# Altium schematic sheet boot_cfg.SchDoc
size A2; SheetNumber: 12; SheetTotal: 15
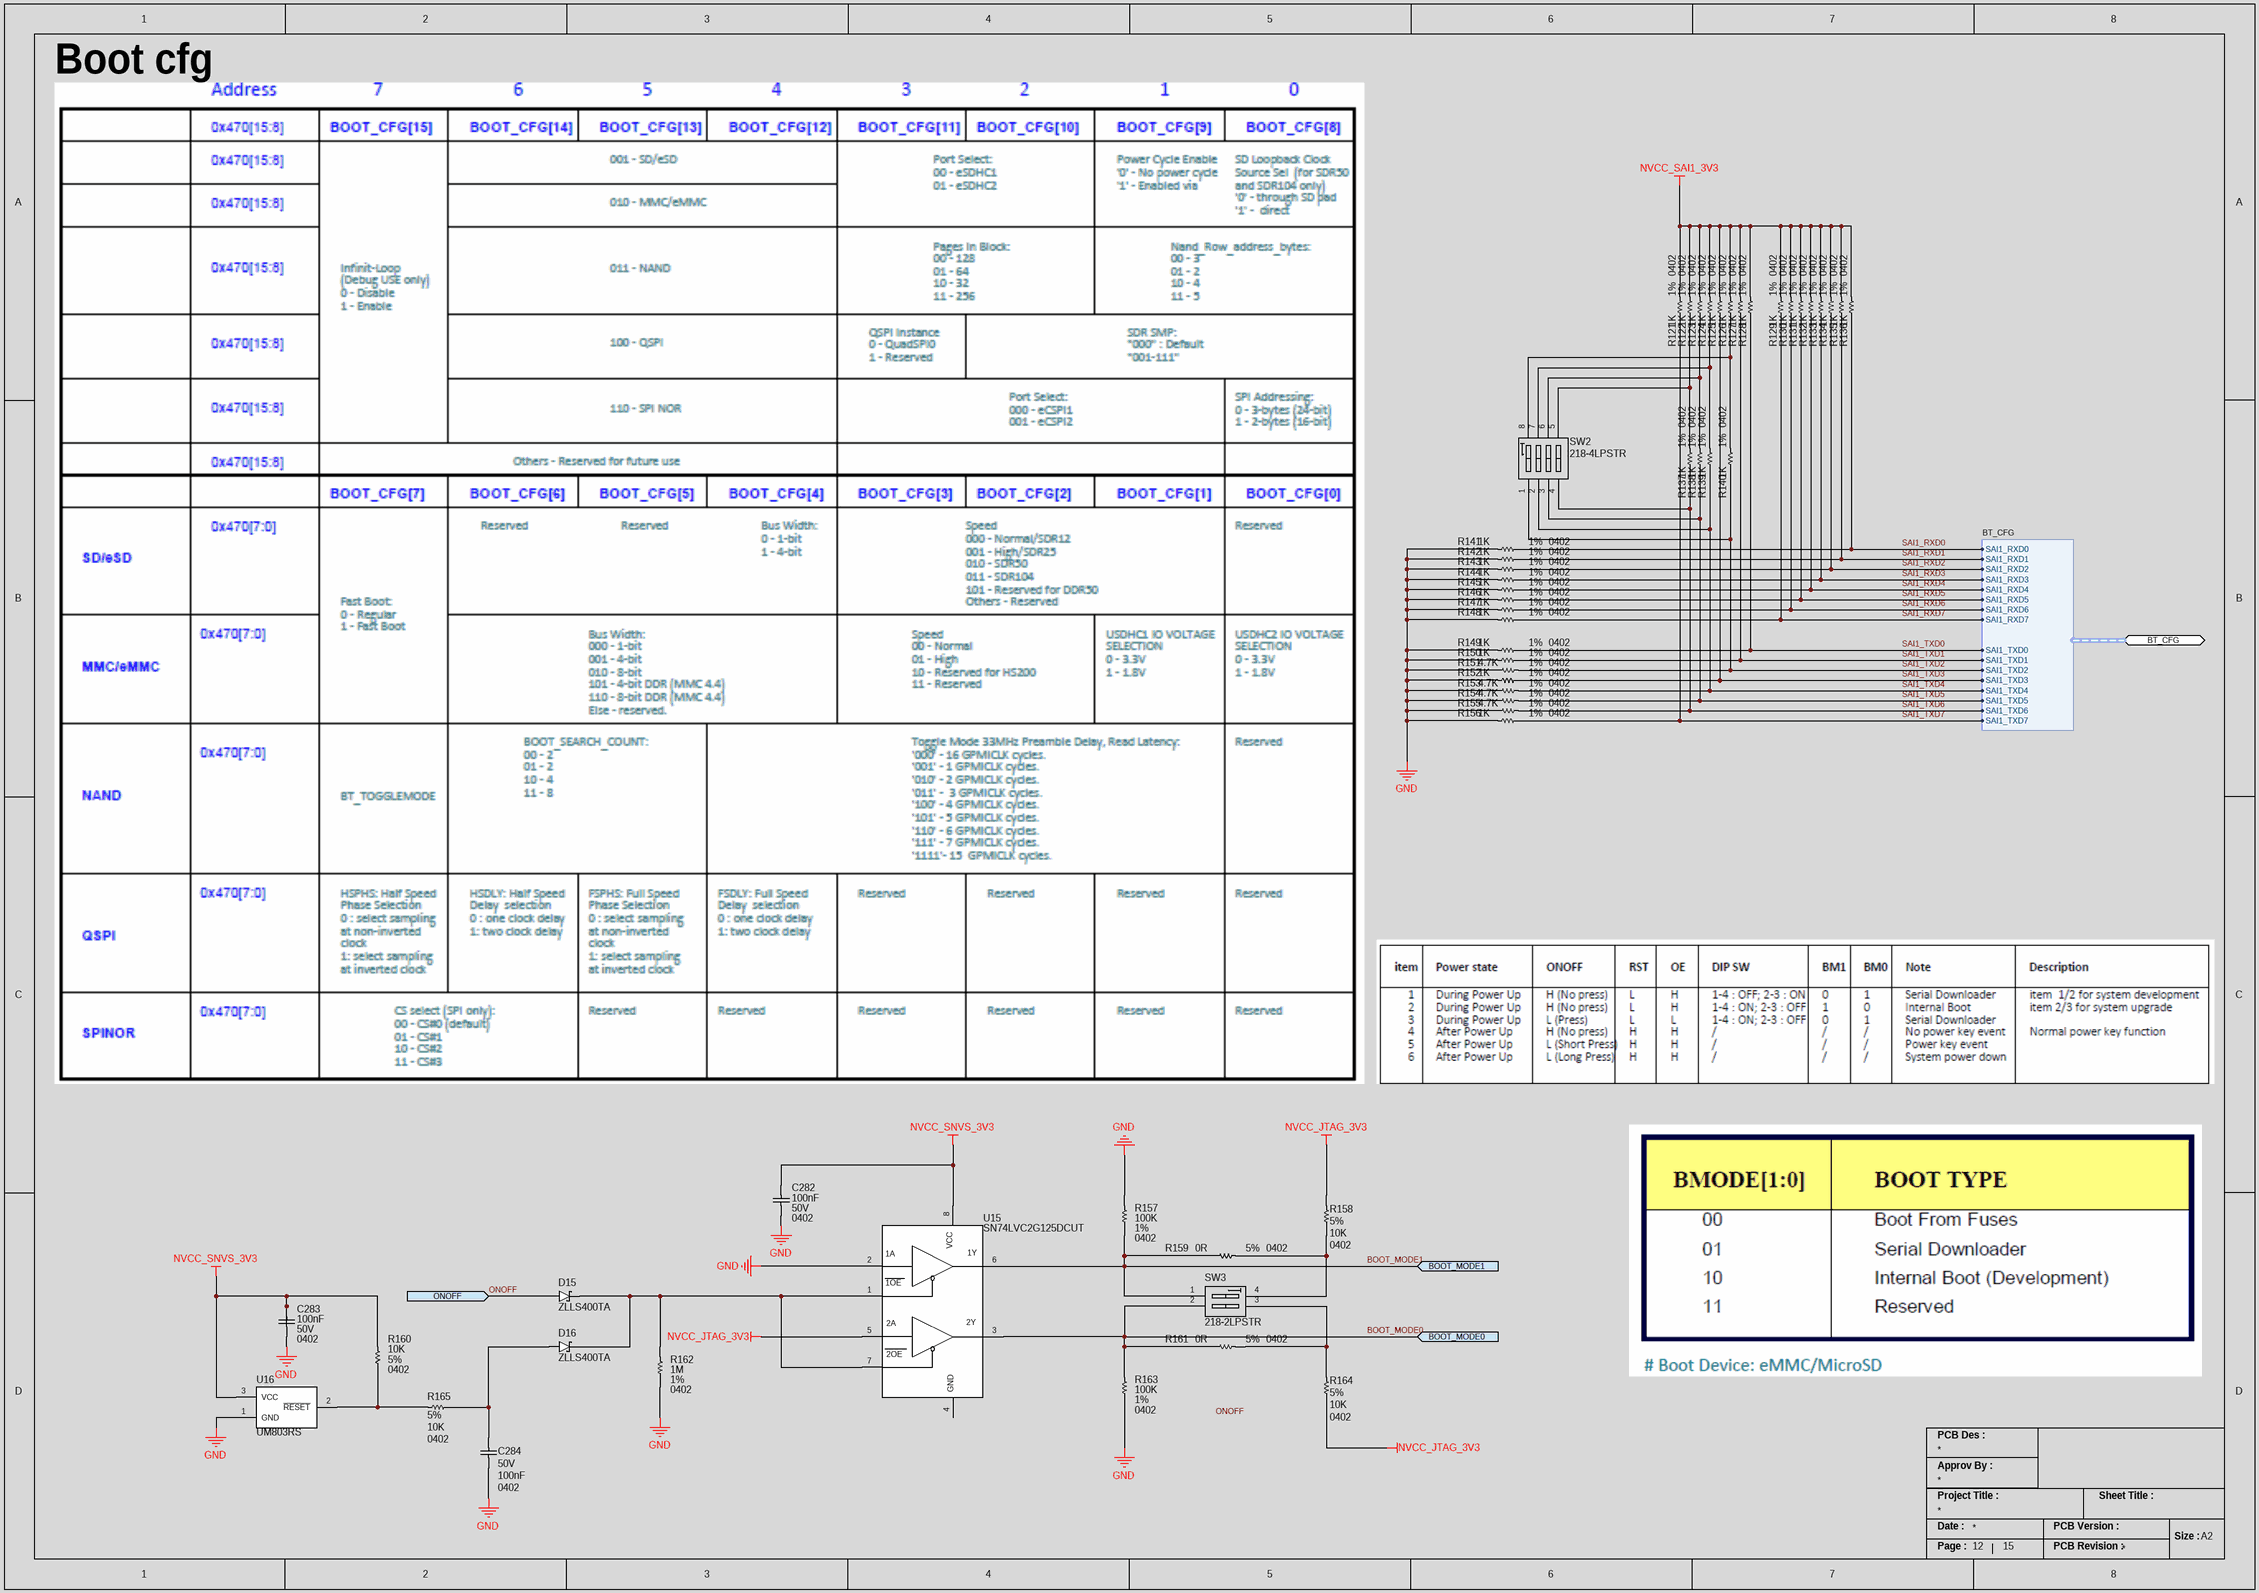
[diagram p0: boot_cfg.SchDoc]

## Parts
C282  Voltage Rating: 50V  Capacitance: 100nF  Case/Package: 0402  [CAP_0402_CAPC1005X05N]  (hidden comment: GRM155R71H104KE14D)
C283  Voltage Rating: 50V  Capacitance: 100nF  Case/Package: 0402  [CAP_0402_CAPC1005X05N]  (hidden comment: GRM155R71H104KE14D)
C284  Voltage Rating: 50V  Capacitance: 100nF  Case/Package: 0402  [CAP_0402_CAPC1005X05N]  (hidden comment: GRM155R71H104KE14D)
D15  ZLLS400TA  [DIO_SOD2512X113N]
D16  ZLLS400TA  [DIO_SOD2512X113N]
R121  Resistance: 1K  Tolerance: 1%  Case/Package: 0402  [RES_0402_RESC1005X04N]  (hidden comment: ERJ-2RKF1001X)
R122  Resistance: 1K  Tolerance: 1%  Case/Package: 0402  [RES_0402_RESC1005X04N]  (hidden comment: ERJ-2RKF1001X)
R123  Resistance: 1K  Tolerance: 1%  Case/Package: 0402  [RES_0402_RESC1005X04N]  (hidden comment: ERJ-2RKF1001X)
R124  Resistance: 1K  Tolerance: 1%  Case/Package: 0402  [RES_0402_RESC1005X04N]  (hidden comment: ERJ-2RKF1001X)
R125  Resistance: 1K  Tolerance: 1%  Case/Package: 0402  [RES_0402_RESC1005X04N]  (hidden comment: ERJ-2RKF1001X)
R126  Resistance: 1K  Tolerance: 1%  Case/Package: 0402  [RES_0402_RESC1005X04N]  (hidden comment: ERJ-2RKF1001X)
R127  Resistance: 1K  Tolerance: 1%  Case/Package: 0402  [RES_0402_RESC1005X04N]  (hidden comment: ERJ-2RKF1001X)
R128  Resistance: 1K  Tolerance: 1%  Case/Package: 0402  [RES_0402_RESC1005X04N]  (hidden comment: ERJ-2RKF1001X)
R129  Resistance: 1K  Tolerance: 1%  Case/Package: 0402  [RES_0402_RESC1005X04N]  (hidden comment: ERJ-2RKF1001X)
R130  Resistance: 1K  Tolerance: 1%  Case/Package: 0402  [RES_0402_RESC1005X04N]  (hidden comment: ERJ-2RKF1001X)
R131  Resistance: 1K  Tolerance: 1%  Case/Package: 0402  [RES_0402_RESC1005X04N]  (hidden comment: ERJ-2RKF1001X)
R132  Resistance: 1K  Tolerance: 1%  Case/Package: 0402  [RES_0402_RESC1005X04N]  (hidden comment: ERJ-2RKF1001X)
R133  Resistance: 1K  Tolerance: 1%  Case/Package: 0402  [RES_0402_RESC1005X04N]  (hidden comment: ERJ-2RKF1001X)
R134  Resistance: 1K  Tolerance: 1%  Case/Package: 0402  [RES_0402_RESC1005X04N]  (hidden comment: ERJ-2RKF1001X)
R135  Resistance: 1K  Tolerance: 1%  Case/Package: 0402  [RES_0402_RESC1005X04N]  (hidden comment: ERJ-2RKF1001X)
R136  Resistance: 1K  Tolerance: 1%  Case/Package: 0402  [RES_0402_RESC1005X04N]  (hidden comment: ERJ-2RKF1001X)
R137  Resistance: 1K  Tolerance: 1%  Case/Package: 0402  [RES_0402_RESC1005X04N]  (hidden comment: ERJ-2RKF1001X)
R138  Resistance: 1K  Tolerance: 1%  Case/Package: 0402  [RES_0402_RESC1005X04N]  (hidden comment: ERJ-2RKF1001X)
R139  Resistance: 1K  Tolerance: 1%  Case/Package: 0402  [RES_0402_RESC1005X04N]  (hidden comment: ERJ-2RKF1001X)
R140  Resistance: 1K  Tolerance: 1%  Case/Package: 0402  [RES_0402_RESC1005X04N]  (hidden comment: ERJ-2RKF1001X)
R141  Resistance: 1K  Tolerance: 1%  Case/Package: 0402  [RES_0402_RESC1005X04N]  (hidden comment: ERJ-2RKF1001X)
R142  Resistance: 1K  Tolerance: 1%  Case/Package: 0402  [RES_0402_RESC1005X04N]  (hidden comment: ERJ-2RKF1001X)
R143  Resistance: 1K  Tolerance: 1%  Case/Package: 0402  [RES_0402_RESC1005X04N]  (hidden comment: ERJ-2RKF1001X)
R144  Resistance: 1K  Tolerance: 1%  Case/Package: 0402  [RES_0402_RESC1005X04N]  (hidden comment: ERJ-2RKF1001X)
R145  Resistance: 1K  Tolerance: 1%  Case/Package: 0402  [RES_0402_RESC1005X04N]  (hidden comment: ERJ-2RKF1001X)
R146  Resistance: 1K  Tolerance: 1%  Case/Package: 0402  [RES_0402_RESC1005X04N]  (hidden comment: ERJ-2RKF1001X)
R147  Resistance: 1K  Tolerance: 1%  Case/Package: 0402  [RES_0402_RESC1005X04N]  (hidden comment: ERJ-2RKF1001X)
R148  Resistance: 1K  Tolerance: 1%  Case/Package: 0402  [RES_0402_RESC1005X04N]  (hidden comment: ERJ-2RKF1001X)
R149  Resistance: 1K  Tolerance: 1%  Case/Package: 0402  [RES_0402_RESC1005X04N]  (hidden comment: ERJ-2RKF1001X)
R150  Resistance: 1K  Tolerance: 1%  Case/Package: 0402  [RES_0402_RESC1005X04N]  (hidden comment: ERJ-2RKF1001X)
R151  Tolerance: 1%  Case Code (Imperial): 0402  Resistance: 4.7K  [RES_0402_RESC1005X04N]  (hidden comment: ERJ-2RKF4701X)
R152  Resistance: 1K  Tolerance: 1%  Case/Package: 0402  [RES_0402_RESC1005X04N]  (hidden comment: ERJ-2RKF1001X)
R153  Tolerance: 1%  Case Code (Imperial): 0402  Resistance: 4.7K  [RES_0402_RESC1005X04N]  (hidden comment: ERJ-2RKF4701X)
R154  Tolerance: 1%  Case Code (Imperial): 0402  Resistance: 4.7K  [RES_0402_RESC1005X04N]  (hidden comment: ERJ-2RKF4701X)
R155  Tolerance: 1%  Case Code (Imperial): 0402  Resistance: 4.7K  [RES_0402_RESC1005X04N]  (hidden comment: ERJ-2RKF4701X)
R156  Resistance: 1K  Tolerance: 1%  Case/Package: 0402  [RES_0402_RESC1005X04N]  (hidden comment: ERJ-2RKF1001X)
R157  Resistance: 100K  Tolerance: 1%  Case/Package: 0402  [RES_0402_RESC1005X04N]  (hidden comment: RC0402FR-07100KL)
R158  Tolerance: 5%  Resistance: 10K  Case/Package: 0402  [RES_0402_RESC1005X04N]  (hidden comment: ERJ-2GEJ103X)
R159  Case Code (Imperial): 0402  Tolerance: 5%  Resistance: 0R  [RES_0402_RESC1005X04N]  (hidden comment: ERJ-2GE0R00X)
R160  Tolerance: 5%  Resistance: 10K  Case/Package: 0402  [RES_0402_RESC1005X04N]  (hidden comment: ERJ-2GEJ103X)
R161  Case Code (Imperial): 0402  Tolerance: 5%  Resistance: 0R  [RES_0402_RESC1005X04N]  (hidden comment: ERJ-2GE0R00X)
R162  Resistance: 1M  Tolerance: 1%  Case/Package: 0402  [RES_0402_RESC1005X04N]  (hidden comment: CR0402-FX-1004GLF)
R163  Resistance: 100K  Tolerance: 1%  Case/Package: 0402  [RES_0402_RESC1005X04N]  (hidden comment: RC0402FR-07100KL)
R164  Tolerance: 5%  Resistance: 10K  Case/Package: 0402  [RES_0402_RESC1005X04N]  (hidden comment: ERJ-2GEJ103X)
R165  Tolerance: 5%  Resistance: 10K  Case/Package: 0402  [RES_0402_RESC1005X04N]  (hidden comment: ERJ-2GEJ103X)
SW2  218-4LPSTR  [SW_DIP_SOIC127P844X265-8N]
SW3  218-2LPSTR  [SW_DIP_2P_2182LPSTR]
U15  SN74LVC2G125DCUT  [IC_BUFF_SOP50P310X90-8N]
U16  UM803RS  [IC_SUP_VOL_UM805RS]

## Ports
BOOT_MODE0 (in), BOOT_MODE1 (in), BT_CFG (bidir, harness BT_CFG), ONOFF (in)

## Harnesses
BT_CFG: SAI1_RXD0, SAI1_RXD1, SAI1_RXD2, SAI1_RXD3, SAI1_RXD4, SAI1_RXD5, SAI1_RXD6, SAI1_RXD7, SAI1_TXD0, SAI1_TXD1, SAI1_TXD2, SAI1_TXD3, SAI1_TXD4, SAI1_TXD5, SAI1_TXD6, SAI1_TXD7

## Nets
GND: C282.1 C283.1 C284.1 R141.2 R142.2 R143.2 R144.2 R145.2 R146.2 R147.2 R148.2 R149.2 R150.2 R151.1 R152.2 R153.1 R154.1 R155.1 R156.2 R157.2 R162.1 R163.1 U15.2(1A) U16.1(GND)
NVCC_JTAG_3V3: R158.2 R164.1 U15.5(2A)
NVCC_SAI1_3V3: R121.2 R122.2 R123.2 R124.2 R125.2 R126.2 R127.2 R128.2 R129.2 R130.2 R131.2 R132.2 R133.2 R134.2 R135.2 R136.2
NVCC_SNVS_3V3: C282.2 C283.2 R160.2 U15.8(VCC) U16.3(VCC)
BOOT_MODE0: R161.1 R163.2 SW3.2(A2) U15.3(2Y) ; port BOOT_MODE0
BOOT_MODE1: R157.1 R159.1 SW3.1(A1) U15.6(1Y) ; port BOOT_MODE1
ONOFF: D15.2(A) ; port ONOFF
SAI1_RXD0: R136.1 R141.1 ; port BT_CFG.SAI1_RXD0
SAI1_RXD1: R135.1 R142.1 ; port BT_CFG.SAI1_RXD1
SAI1_RXD2: R134.1 R143.1 ; port BT_CFG.SAI1_RXD2
SAI1_RXD3: R133.1 R144.1 ; port BT_CFG.SAI1_RXD3
SAI1_RXD4: R132.1 R145.1 ; port BT_CFG.SAI1_RXD4
SAI1_RXD5: R131.1 R146.1 ; port BT_CFG.SAI1_RXD5
SAI1_RXD6: R130.1 R147.1 ; port BT_CFG.SAI1_RXD6
SAI1_RXD7: R129.1 R148.1 ; port BT_CFG.SAI1_RXD7
SAI1_TXD0: R128.1 R149.1 ; port BT_CFG.SAI1_TXD0
SAI1_TXD1: R127.1 R150.1 ; port BT_CFG.SAI1_TXD1
SAI1_TXD2: R140.1 R151.2 SW2.1(A1) ; port BT_CFG.SAI1_TXD2
SAI1_TXD3: R125.1 R152.1 ; port BT_CFG.SAI1_TXD3
SAI1_TXD4: R139.1 R153.2 SW2.2(A2) ; port BT_CFG.SAI1_TXD4
SAI1_TXD5: R138.1 R154.2 SW2.3(A3) ; port BT_CFG.SAI1_TXD5
SAI1_TXD6: R137.1 R155.2 SW2.4(A4) ; port BT_CFG.SAI1_TXD6
SAI1_TXD7: R121.1 R156.1 ; port BT_CFG.SAI1_TXD7
NetC284_2: C284.2 D16.2(A) R165.1
NetD15_1: D15.1(K) D16.1(K) R162.2 U15.1(~{1OE}) U15.7(~{2OE})
NetR122_1: R122.1 R137.2 SW2.5(B4)
NetR123_1: R123.1 R138.2 SW2.6(B3)
NetR124_1: R124.1 R139.2 SW2.7(B2)
NetR126_1: R126.1 R140.2 SW2.8(B1)
NetR158_1: R158.1 R159.2 SW3.4(B1)
NetR160_1: R160.1 R165.2 U16.2(~{RESET})
NetR161_2: R161.2 R164.2 SW3.3(B2)

Not connected (* = marked no-connect by the designer): U15 4(GND)

## Notes on the sheet
- Boot cfg
- Labels drawn without touching a wire or pin: ONOFF
- PCB Des :
- Approv By :
- Project Title :
- Sheet Title :
- Date :
- Page :
- PCB Version :
- PCB Revision :
- Size :
- A2
- (in symbol IC_BUFFER_2CH_SN74LVC2G125DCUT) 1OE; 2OE

## Library data of the parts
C282-C284 = CAP_100NF_50V_X7R_0402: Multilayer Ceramic Capacitor, 0.1 uF, 16 V, ± 10%, X7R, 0402 [1005 Metric]; Manufacturer: Murata; Dissipation Factor: 0.025%; Temperature Coefficient: 30ppm/°C; Supplier 1: DigiKey; Manufacturer Part Number: GRM155R71H104KE14D; RoHS: Yes; Category: Ceramic Capacitors; Stock 1: 13730790; Pricing 1: 1=0.1, 10=0.023, 50=0.0132, 100=0.0102, 500=0.00768, 1000=0.00603, 2500=0.00548, 5000=0.00504 (USD); Mount: Surface Mount; Number of Pins: 2NUMBER; Case Code (Metric): 1005; Material: Ceramic; Case Code (Imperial): 0402; Weight: 0.000212oz; Dielectric Material: Ceramic; Min Operating Temperature: -55°C; Max Operating Temperature: 125°C; Packaging: Tape and Reel; Package Quantity: 10000; Series: GRM; Tolerance: 10%; Dielectric: X7R; Termination: SMD/SMT; Voltage: 50V; Voltage Rating (DC): 50V; Construction: Flat; Length: 1mm; Width: 0.5mm; Height: 0.5mm; Depth: 0.5mm; Thickness: 0.022inch; Reach SVHC Compliant: No; RoHS Compliant: Yes; Lead Free: 5697LeadFree; ComponentLink1URL: http://www.farnell.com/datasheets/2079156.pdf?src-supplier=Farnell; ComponentLink1Description: http://www.farnell.com/datasheets/2079156.pdf?src-supplier=Farnell; ComponentLink2URL: http://www.mouser.com/ds/2/281/c02e-2905.pdf?src-supplier=Mouser; ComponentLink2Description: http://www.mouser.com/ds/2/281/c02e-2905.pdf?src-supplier=Mouser; ComponentLink3URL: http://www.farnell.com/datasheets/2079156.pdf?src-supplier=Newark; ComponentLink3Description: http://www.farnell.com/datasheets/2079156.pdf?src-supplier=Newark; ComponentLink4URL: https://datasheet.octopart.com/GRM155R71H104KE14D-Murata-datasheet-22122223.pdf?src-supplier=Future+Electronics; ComponentLink4Description: https://datasheet.octopart.com/GRM155R71H104KE14D-Murata-datasheet-22122223.pdf?src-supplier=Future+Electronics; ComponentLink5URL: https://search.murata.co.jp/Ceramy/image/img/A01X/G101/ENG/GRM155R71H104KE14-01.pdf?src-supplier=Digi-Key; ComponentLink5Description: https://search.murata.co.jp/Ceramy/image/img/A01X/G101/ENG/GRM155R71H104KE14-01.pdf?src-supplier=Digi-Key; ComponentLink6URL: http://psearch.en.murata.com/capacitor/product/GRM155R71H104KE14%23.pdf?src-supplier=Avnet; ComponentLink6Description: http://psearch.en.murata.com/capacitor/product/GRM155R71H104KE14%23.pdf?src-supplier=Avnet; ComponentLink7URL: https://datasheet.octopart.com/GRM155R71H104KE14D-Murata-datasheet-66077078.pdf?src-supplier=Element14; ComponentLink7Description: https://datasheet.octopart.com/GRM155R71H104KE14D-Murata-datasheet-66077078.pdf?src-supplier=Element14; Supplier Part Number 1: 490-10700-6-ND; Supplier 2: Digikey; Stock 2: 3706055; Pricing 2: 1=0.1, 10=0.037, 50=0.021, 100=0.0162, 500=0.01224, 1000=0.00961, 2500=0.00874, 5000=0.00804 (USD); Halogen Free: 5694HalogenFree; ComponentLink8URL: http://www.mouser.com/ds/2/447/UPY-GPHC_X5R_4V-to-50V_25-1131599.pdf?src-supplier=Mouser; ComponentLink8Description: http://www.mouser.com/ds/2/447/UPY-GPHC_X5R_4V-to-50V_25-1131599.pdf?src-supplier=Mouser; ComponentLink9URL: https://datasheet.octopart.com/CC0402KRX5R8BB104-Yageo-datasheet-137700082.pdf?src-supplier=Future+Electronics; ComponentLink9Description: https://datasheet.octopart.com/CC0402KRX5R8BB104-Yageo-datasheet-137700082.pdf?src-supplier=Future+Electronics; ComponentLink10URL: http://www.yageo.com/documents/recent/UPY-GPHC_X5R_4V-to-50V_25.pdf?src-supplier=Digikey; ComponentLink10Description: http://www.yageo.com/documents/recent/UPY-GPHC_X5R_4V-to-50V_25.pdf?src-supplier=Digikey; ComponentLink11URL: https://datasheet.octopart.com/CC0402KRX5R8BB104-Yageo-datasheet-140260304.pdf?src-supplier=Newark; ComponentLink11Description: https://datasheet.octopart.com/CC0402KRX5R8BB104-Yageo-datasheet-140260304.pdf?src-supplier=Newark; ComponentLink12URL: https://datasheet.octopart.com/CC0402KRX5R8BB104-Yageo-datasheet-170350636.pdf?src-supplier=Future+Electronics; ComponentLink12Description: https://datasheet.octopart.com/CC0402KRX5R8BB104-Yageo-datasheet-170350636.pdf?src-supplier=Future+Electronics; ComponentLink13URL: http://www.yageo.com/documents/recent/UPY-GPHC_X5R_4V-to-50V-16.pdf?src-supplier=Future+Electronics; ComponentLink13Description: http://www.yageo.com/documents/recent/UPY-GPHC_X5R_4V-to-50V-16.pdf?src-supplier=Future+Electronics; Supplier Part Number 2: 311-1697-1-ND
D15 D16 = DIO_SCTKY_40V_520mA_ZLLS400TA: DIODE SCHOTTKY 40V 520MA SOD323; Manufacturer: Diodes Zetex; Peak Non-Repetitive Surge Current: 12A; Max Reverse Current: 10uA; Forward Voltage: 800mV; Reverse Recovery Time: 3ns; Max Forward Surge Current (Ifsm): 2.5A; Power Dissipation: 330mW; Polarity: Standard; Capacitance: 15pF; Supplier 1: Digi-Key; Manufacturer Part Number: ZLLS400TA; RoHS: Yes; Category: Rectifier Diodes; Stock 1: 46017; Pricing 1: 1=0.42, 10=0.359, 100=0.2495, 500=0.19478, 1000=0.15832 (USD); Mount: Surface Mount; Number of Pins: 2; Weight: 0.000173oz; Min Operating Temperature: -55°C; Max Operating Temperature: 150°C; Forward Current: 520mA; Max Repetitive Reverse Voltage (Vrrm): 40V; Package Quantity: 3000; Packaging: Tape and Reel; Average Rectified Current: 520mA; Termination: SMD/SMT; Voltage Rating (DC): 40V; Current Rating: 520mA; Output Current: 520mA; Max Reverse Voltage (DC): 40V; Series: -; Length: 1.8mm; Width: 1.4mm; Height: 0.8mm; Radiation Hardening: No; Lead Free: Lead Free; RoHS Compliant: Yes; ComponentLink1URL: https://datasheet.ciiva.com/914/zlls400-914210.pdf?src-supplier=Digi-Key; ComponentLink1Description: https://datasheet.ciiva.com/914/zlls400-914210.pdf?src-supplier=Digi-Key; ComponentLink2URL: https://datasheet.ciiva.com/914/zlls400-914210.pdf?src-supplier=Avnet; ComponentLink2Description: https://datasheet.ciiva.com/914/zlls400-914210.pdf?src-supplier=Avnet; ComponentLink3URL: https://datasheet.ciiva.com/4715/zlls400-4715517.pdf?src-supplier=Mouser; ComponentLink3Description: https://datasheet.ciiva.com/4715/zlls400-4715517.pdf?src-supplier=Mouser; ComponentLink4URL: https://datasheet.ciiva.com/16379/zlls400-16379288.pdf?src-supplier=Future+Electronics; ComponentLink4Description: https://datasheet.ciiva.com/16379/zlls400-16379288.pdf?src-supplier=Future+Electronics; ComponentLink5URL: https://datasheet.ciiva.com/914/zlls400-914211.pdf?src-supplier=Digi-Key; ComponentLink5Description: https://datasheet.ciiva.com/914/zlls400-914211.pdf?src-supplier=Digi-Key; ComponentLink6URL: https://datasheet.ciiva.com/914/zlls400-914212.pdf?src-supplier=Digi-Key; ComponentLink6Description: https://datasheet.ciiva.com/914/zlls400-914212.pdf?src-supplier=Digi-Key; Supplier Part Number 1: ZLLS400TACT-ND
R121-R150 R152 R156 = RES_1K_1%_100mW_0402: RES SMD 1K OHM 1% 1/10W 0402; Manufacturer: Panasonic; Temperature Coefficient: 100ppm/°C; Max Power Dissipation: 100mW; Voltage Rating (DC): 50V; Supplier 1: Digi-Key; Manufacturer Part Number: ERJ-2RKF1001X; RoHS: Yes; Category: Chip SMD Resistors; Stock 1: 2367361; Pricing 1: 1=0.1, 10=0.029, 50=0.0162, 100=0.0119, 500=0.00728, 1000=0.00535, 5000=0.00384 (USD); Mount: Surface Mount; Number of Pins: 2; Case Code (Imperial): 0402; Case Code (Metric): 1005; Contact Plating: Tin; Min Operating Temperature: -55°C; Max Operating Temperature: 155°C; Packaging: Tape and Reel; Number of Terminations: 2; Features: Automotive AEC-Q200; Voltage Rating: 50V; Power Rating: 100mW; Package Quantity: 1; Termination: SMD/SMT; Resistor Type: Thick Film; Series: ERJ; Resistance Tolerance: 1%; Construction: Rectangular; Technology: THICK FILM; Length: 1mm; Width: 0.5mm; Height: 0.35mm; Depth: 0.5mm; Lead Free: Lead Free; RoHS Compliant: Yes; Reach SVHC Compliant: Yes; Military Standard: Not; Supplier Part Number 1: P1.00KLCT-ND
R151 R153-R155 = RES_4.7K_1%_100mW_0402: Res Thick Film 0402 4.7K Ohm 1% 0.1W ±100ppm/°C Molded SMD Punched Carrier T/R; Manufacturer: Panasonic; Power Rating: 100mW; Voltage Rating: 50V; Supplier 1: Digi-Key; Manufacturer Part Number: ERJ-2RKF4701X; RoHS: Yes; Category: Chip SMD Resistors; Stock 1: 2269675; Pricing 1: 1=0.1, 10=0.024, 50=0.015, 100=0.0125, 500=0.00848, 1000=0.00731, 5000=0.00531 (USD); Case Code (Metric): 1005; Weight: 0.000388oz; Min Operating Temperature: -55°C; Max Operating Temperature: 155°C; Temperature Coefficient: 100ppm/°C; Packaging: Cut Tape; Package Quantity: 10000; Termination: SMD/SMT; Voltage Rating (DC): 50V; Series: ERJ-2Rx; Technology: THICK FILM; Length: 1mm; Width: 0.5mm; Height: 0.35mm; Lead Free: Lead Free; RoHS Compliant: Yes; ComponentLink1URL: https://datasheet.ciiva.com/30053/aoa0000ce2-30053990.pdf?src-supplier=Onlinecomponents.com; ComponentLink1Description: https://datasheet.ciiva.com/30053/aoa0000ce2-30053990.pdf?src-supplier=Onlinecomponents.com; ComponentLink2URL: https://datasheet.ciiva.com/7830/aoa0000ce2-7830727.pdf?src-supplier=Element14; ComponentLink2Description: https://datasheet.ciiva.com/7830/aoa0000ce2-7830727.pdf?src-supplier=Element14; ComponentLink3URL: https://datasheet.ciiva.com/22781/1678782-22781576.pdf?src-supplier=Farnell; ComponentLink3Description: https://datasheet.ciiva.com/22781/1678782-22781576.pdf?src-supplier=Farnell; ComponentLink4URL: https://datasheet.ciiva.com/22667/1678782-22667886.pdf?src-supplier=Element14; ComponentLink4Description: https://datasheet.ciiva.com/22667/1678782-22667886.pdf?src-supplier=Element14; ComponentLink5URL: https://datasheet.ciiva.com/22723/1678782-22723903.pdf?src-supplier=Element14; ComponentLink5Description: https://datasheet.ciiva.com/22723/1678782-22723903.pdf?src-supplier=Element14; Supplier Part Number 1: P4.70KLCT-ND
R157 R163 = RES_100K_1%_100mW_0402: SMD Chip Resistor, 100 kOhm, ± 1%, 63 mW, 0402 [1005 Metric], Thick Film, General Purpose; Manufacturer: Yageo; Temperature Coefficient: 100ppm/°C; Power Rating: 63mW; Voltage Rating: 50V; Supplier 1: Digi-Key; Manufacturer Part Number: RC0402FR-07100KL; RoHS: Yes; Category: Chip SMD Resistors; Stock 1: 27579413; Pricing 1: 1=0.1, 10=0.014, 50=0.0084, 100=0.007, 500=0.00464, 1000=0.00396, 5000=0.00282 (USD); Case Code (Metric): 1005; Case Code (Imperial): 0402; Min Operating Temperature: -55°C; Max Operating Temperature: 155°C; Resistor Type: Thick Film; Packaging: Tape and Reel; Package Quantity: 1; Number of Terminations: 2; Termination: SMD/SMT; Max Power Dissipation: 63mW; Features: Moisture Resistant; Series: RC; Resistance Tolerance: 1%; Construction: Rectangular; Technology: THICK FILM; Voltage Rating (AC): 50V; Length: 0.039inch; Width: 0.02inch; Height: 0.016inch; Depth: 0.5mm; Reach SVHC Compliant: No; RoHS Compliant: Yes; Lead Free: 5697LeadFree; Military Standard: Not; ComponentLink1URL: https://datasheet.ciiva.com/11819/0900766b80c66297-11819452.pdf?src-supplier=Rs; ComponentLink1Description: https://datasheet.ciiva.com/11819/0900766b80c66297-11819452.pdf?src-supplier=Rs; ComponentLink2URL: https://datasheet.ciiva.com/22747/1018594-22747509.pdf?src-supplier=Element14; ComponentLink2Description: https://datasheet.ciiva.com/22747/1018594-22747509.pdf?src-supplier=Element14; ComponentLink3URL: https://datasheet.ciiva.com/2453/pyu-r-int-thick-7-2453362.pdf?src-supplier=Digi-Key; ComponentLink3Description: https://datasheet.ciiva.com/2453/pyu-r-int-thick-7-2453362.pdf?src-supplier=Digi-Key; ComponentLink4URL: https://datasheet.ciiva.com/12667/pyu-rc0402-51-rohs-l-6-r-12667930.pdf?src-supplier=Mouser; ComponentLink4Description: https://datasheet.ciiva.com/12667/pyu-rc0402-51-rohs-l-6-r-12667930.pdf?src-supplier=Mouser; ComponentLink5URL: https://datasheet.ciiva.com/15189/getdatasheetpartid-323696-15189334.pdf?src-supplier=Verical; ComponentLink5Description: https://datasheet.ciiva.com/15189/getdatasheetpartid-323696-15189334.pdf?src-supplier=Verical; ComponentLink6URL: https://datasheet.ciiva.com/2453/pyu-r-int-thick-7-2453363.pdf?src-supplier=Digi-Key; ComponentLink6Description: https://datasheet.ciiva.com/2453/pyu-r-int-thick-7-2453363.pdf?src-supplier=Digi-Key; ComponentLink7URL: https://datasheet.ciiva.com/2453/pyu-r-int-thick-7-2453361.pdf?src-supplier=Digi-Key; ComponentLink7Description: https://datasheet.ciiva.com/2453/pyu-r-int-thick-7-2453361.pdf?src-supplier=Digi-Key; Supplier Part Number 1: 311-100KLRCT-ND
R158 R160 R164 R165 = RES_10K_5%_100mW_0402: Res Thick Film 0402 10K Ohm 5% 1/10W ±200ppm/°C Molded SMD Punched Carrier T/R; Manufacturer: Panasonic; Power Rating: 100mW; Voltage Rating: 50V; Supplier 1: Digi-Key; Manufacturer Part Number: ERJ-2GEJ103X; RoHS: Yes; Category: Chip SMD Resistors; Stock 1: 4696986; Pricing 1: 1=0.1, 10=0.021, 50=0.0132, 100=0.011, 500=0.00744, 1000=0.00639, 5000=0.00464 (USD); Mount: Surface Mount; Contact Plating: Tin; Case Code (Metric): 1005; Case Code (Imperial): 0402; Size Code: 0402; Min Operating Temperature: -55°C; Max Operating Temperature: 155°C; Temperature Coefficient: 200ppm/°C; Packaging: Cut Tape; Resistor Type: Thick Film; Package Quantity: 10000; Number of Terminations: 2; Termination: SMD/SMT; Max Power Dissipation: 100mW; Features: Automotive AEC-Q200; Series: ERJ; Resistance Tolerance: 5%; Technology: THICK FILM; Voltage Rating (DC): 50V; Length: 1mm; Width: 0.5mm; Height: 0.35mm; Depth: 0.5mm; Ratings: AEC-Q200; Radiation Hardening: No; Reach SVHC Compliant: No; RoHS Compliant: Yes; Lead Free: 5697LeadFree; ComponentLink1URL: https://datasheet.ciiva.com/27055/1935721-27055112.pdf?src-supplier=Jameco; ComponentLink1Description: https://datasheet.ciiva.com/27055/1935721-27055112.pdf?src-supplier=Jameco; ComponentLink2URL: https://datasheet.ciiva.com/11821/0900766b80f806dd-11821170.pdf?src-supplier=Rs; ComponentLink2Description: https://datasheet.ciiva.com/11821/0900766b80f806dd-11821170.pdf?src-supplier=Rs; ComponentLink3URL: https://datasheet.ciiva.com/43460/1678796-43460391.pdf?src-supplier=Farnell; ComponentLink3Description: https://datasheet.ciiva.com/43460/1678796-43460391.pdf?src-supplier=Farnell; ComponentLink4URL: https://datasheet.ciiva.com/22785/1678796-22785949.pdf?src-supplier=Farnell; ComponentLink4Description: https://datasheet.ciiva.com/22785/1678796-22785949.pdf?src-supplier=Farnell; ComponentLink5URL: https://datasheet.ciiva.com/46371/1678796-46371910.pdf?src-supplier=Element14; ComponentLink5Description: https://datasheet.ciiva.com/46371/1678796-46371910.pdf?src-supplier=Element14; ComponentLink6URL: https://datasheet.ciiva.com/28514/1678796-28514154.pdf?src-supplier=Element14; ComponentLink6Description: https://datasheet.ciiva.com/28514/1678796-28514154.pdf?src-supplier=Element14; ComponentLink7URL: https://datasheet.ciiva.com/24070/aoa0000ce1-37422-24070679.pdf?src-supplier=Mouser; ComponentLink7Description: https://datasheet.ciiva.com/24070/aoa0000ce1-37422-24070679.pdf?src-supplier=Mouser; ComponentLink8URL: https://datasheet.ciiva.com/16767/70260739-16767130.pdf?src-supplier=Allied+Electronics; ComponentLink8Description: https://datasheet.ciiva.com/16767/70260739-16767130.pdf?src-supplier=Allied+Electronics; ComponentLink9URL: https://datasheet.ciiva.com/16774/70260739-16774504.pdf?src-supplier=Allied+Electronics; ComponentLink9Description: https://datasheet.ciiva.com/16774/70260739-16774504.pdf?src-supplier=Allied+Electronics; ComponentLink10URL: https://datasheet.ciiva.com/9194/aoa0000ce1-9194140.pdf?src-supplier=Avnet; ComponentLink10Description: https://datasheet.ciiva.com/9194/aoa0000ce1-9194140.pdf?src-supplier=Avnet; Supplier Part Number 1: P10KJCT-ND
R159 R161 = RES_0R_5%_100mW_0402: SMD Chip Resistor, Jumper, 0 ohm, 100 mW, 0402 [1005 Metric], Thick Film, General Purpose; Manufacturer: Panasonic; Power Rating: 100mW; Voltage Rating: 50V; Temperature Coefficient: 600ppm/°C; Supplier 1: Mouser; Manufacturer Part Number: ERJ-2GE0R00X; RoHS: Yes; Category: Chip SMD Resistors; Stock 1: 10989354; Pricing 1: 1=0.1, 10=0.013, 50=0.013, 100=0.006, 1000=0.004, 2500=0.003, 10000=0.003 (USD); Mount: Surface Mount; Case/Package: 0402; Contact Plating: Tin; Case Code (Metric): 1005; Size Code: 0402; Min Operating Temperature: -55°C; Max Operating Temperature: 155°C; Resistor Type: Thick Film; Packaging: Cut Tape; Package Quantity: 10000; Number of Terminations: 2; Termination: SMD/SMT; Max Power Dissipation: 100mW; Voltage Rating (DC): 50V; Features: Automotive AEC-Q200; Series: ERJ; Construction: Rectangular; Technology: THICK FILM; Length: 1mm; Width: 0.5mm; Height: 0.35mm; Depth: 0.5mm; Ratings: AEC-Q200; Radiation Hardening: No; Reach SVHC Compliant: No; Military Standard: Not; Lead Free: Lead Free; RoHS Compliant: Yes; ComponentLink1URL: https://datasheet.ciiva.com/11821/0900766b80f806dd-11821176.pdf?src-supplier=Rs; ComponentLink1Description: https://datasheet.ciiva.com/11821/0900766b80f806dd-11821176.pdf?src-supplier=Rs; ComponentLink2URL: https://datasheet.ciiva.com/43460/1678796-43460347.pdf?src-supplier=Farnell; ComponentLink2Description: https://datasheet.ciiva.com/43460/1678796-43460347.pdf?src-supplier=Farnell; ComponentLink3URL: https://datasheet.ciiva.com/46389/1678796-46389518.pdf?src-supplier=Element14; ComponentLink3Description: https://datasheet.ciiva.com/46389/1678796-46389518.pdf?src-supplier=Element14; ComponentLink4URL: https://datasheet.ciiva.com/5959/1678796-5959692.pdf?src-supplier=Farnell; ComponentLink4Description: https://datasheet.ciiva.com/5959/1678796-5959692.pdf?src-supplier=Farnell; ComponentLink5URL: https://datasheet.ciiva.com/28695/1678796-28695758.pdf?src-supplier=Element14; ComponentLink5Description: https://datasheet.ciiva.com/28695/1678796-28695758.pdf?src-supplier=Element14; ComponentLink6URL: https://datasheet.ciiva.com/16783/70260739-16783734.pdf?src-supplier=Allied+Electronics; ComponentLink6Description: https://datasheet.ciiva.com/16783/70260739-16783734.pdf?src-supplier=Allied+Electronics; ComponentLink7URL: https://datasheet.ciiva.com/16778/70260739-16778335.pdf?src-supplier=Allied+Electronics; ComponentLink7Description: https://datasheet.ciiva.com/16778/70260739-16778335.pdf?src-supplier=Allied+Electronics; ComponentLink8URL: https://datasheet.ciiva.com/48531/aoa0000ce1-48531077.pdf?src-supplier=Avnet; ComponentLink8Description: https://datasheet.ciiva.com/48531/aoa0000ce1-48531077.pdf?src-supplier=Avnet; ComponentLink9URL: https://datasheet.ciiva.com/30097/4aoa0000ce1-30097116.pdf?src-supplier=Onlinecomponents.com; ComponentLink9Description: https://datasheet.ciiva.com/30097/4aoa0000ce1-30097116.pdf?src-supplier=Onlinecomponents.com; Supplier Part Number 1: 667-ERJ-2GE0R00X
R162 = RES_1M_1%_63mW_0402: Res Thick Film 0402 1M Ohm 1% 1/16W ±100ppm/°C Molded SMD SMD Paper Tape on Plastic Reel; Manufacturer: Bourns; Power Rating: 62.5mW; Voltage Rating: 50V; Max Power Dissipation: 63mW; Supplier 1: Digi-Key; Manufacturer Part Number: CR0402-FX-1004GLF; RoHS: Yes; Category: Chip SMD Resistors; Stock 1: 506989; Pricing 1: 1=0.1, 10=0.012, 50=0.0064, 100=0.0052, 500=0.00332, 1000=0.0028, 5000=0.00193 (USD); Mount: Surface Mount; Case Code (Metric): 1005; Case Code (Imperial): 0402; Contact Plating: Tin; Min Operating Temperature: -55°C; Max Operating Temperature: 125°C; Package Quantity: 10000; Packaging: Tape and Reel; Number of Terminations: 2; Termination: SMD/SMT; Temperature Coefficient: 100ppm/°C; Series: CR0402; Voltage Rating (DC): 50V; Length: 1mm; Width: 0.5mm; Height: 0.35mm; Thickness: 356um; Radiation Hardening: No; RoHS Compliant: Yes; ComponentLink1URL: http://www.mouser.com/ds/2/54/CR0402-72074.pdf?src-supplier=Mouser; ComponentLink1Description: http://www.mouser.com/ds/2/54/CR0402-72074.pdf?src-supplier=Mouser; ComponentLink2URL: http://www.farnell.com/datasheets/2194437.pdf?src-supplier=Farnell; ComponentLink2Description: http://www.farnell.com/datasheets/2194437.pdf?src-supplier=Farnell; ComponentLink3URL: http://components.arrow.com/part/dataview/41873878S8356545N1506?src-supplier=Arrow+Electronics; ComponentLink3Description: http://components.arrow.com/part/dataview/41873878S8356545N1506?src-supplier=Arrow+Electronics; ComponentLink4URL: https://datasheet.octopart.com/CR0402-FX-1004GLF-Bourns-datasheet-68301632.pdf?src-supplier=Farnell; ComponentLink4Description: https://datasheet.octopart.com/CR0402-FX-1004GLF-Bourns-datasheet-68301632.pdf?src-supplier=Farnell; ComponentLink5URL: http://www.bourns.com/pdfs/CR0402.pdf?src-supplier=Avnet; ComponentLink5Description: http://www.bourns.com/pdfs/CR0402.pdf?src-supplier=Avnet; ComponentLink6URL: https://www.bourns.com/docs/Product-Datasheets/CR0402.pdf?src-supplier=Digi-Key; ComponentLink6Description: https://www.bourns.com/docs/Product-Datasheets/CR0402.pdf?src-supplier=Digi-Key; ComponentLink7URL: http://www.farnell.com/datasheets/2194437.pdf?src-supplier=Element14; ComponentLink7Description: http://www.farnell.com/datasheets/2194437.pdf?src-supplier=Element14; ComponentLink8URL: http://www.farnell.com/datasheets/2194437.pdf?src-supplier=Newark; ComponentLink8Description: http://www.farnell.com/datasheets/2194437.pdf?src-supplier=Newark; ComponentLink9URL: https://datasheet.octopart.com/CR0402-FX-1004GLF-Bourns-datasheet-159578630.pdf?src-supplier=Electro+Sonic; ComponentLink9Description: https://datasheet.octopart.com/CR0402-FX-1004GLF-Bourns-datasheet-159578630.pdf?src-supplier=Electro+Sonic; ComponentLink10URL: https://datasheet.octopart.com/CR0402-FX-1004GLF-Bourns-datasheet-140567134.pdf?src-supplier=Arrow.cn; ComponentLink10Description: https://datasheet.octopart.com/CR0402-FX-1004GLF-Bourns-datasheet-140567134.pdf?src-supplier=Arrow.cn; Supplier Part Number 1: CR0402-FX-1004GLFCT-ND
SW2 = SWITCH_DIP_4P_25mA_218-4LPSTR: Switch DIP ON OFF SPST 4 Recessed Slide 0.025A 24VDC Gull Wing 1000Cycles 1.27mm SMD T/R; Manufacturer: CTS; Number of Positions: 4; Voltage Rating (DC): 24V; Actuator Type: Slide (Standard); Max Current Rating: 25mA; Washable: Yes; Supplier 1: Digi-Key; Manufacturer Part Number: 218-4LPSTR; RoHS: Yes; Category: DIP Switches; Stock 1: 12605; Pricing 1: 1=1.08, 10=1.041, 25=0.978, 100=0.8449, 250=0.76996, 500=0.71586, 1000=0.66592 (USD); Mount: Surface Mount; Contact Material: Copper; Contact Plating: Gold; Mechanical Life: 1000Cycles; Min Operating Temperature: -55°C; Max Operating Temperature: 85°C; Throw Configuration: SPST; Packaging: Tape and Reel; Electrical Life: 1000Cycles; Series: 218; Max Voltage Rating (DC): 24V; Termination: Gull Wing; Orientation: Straight; Package Quantity: 2000; Length: 6.25mm; Depth: 8.44mm; Radiation Hardening: No; Lead Free: Lead Free; RoHS Compliant: Yes; ComponentLink1URL: https://datasheet.ciiva.com/8676/218-8676896.pdf?src-supplier=Avnet; ComponentLink1Description: https://datasheet.ciiva.com/8676/218-8676896.pdf?src-supplier=Avnet; ComponentLink2URL: https://datasheet.ciiva.com/8082/218-8082342.pdf?src-supplier=Avnet; ComponentLink2Description: https://datasheet.ciiva.com/8082/218-8082342.pdf?src-supplier=Avnet; ComponentLink3URL: https://datasheet.ciiva.com/16303/218-16303941.pdf?src-supplier=Future+Electronics; ComponentLink3Description: https://datasheet.ciiva.com/16303/218-16303941.pdf?src-supplier=Future+Electronics; ComponentLink4URL: https://datasheet.ciiva.com/15184/getdatasheetpartid-141001-15184860.pdf?src-supplier=Verical; ComponentLink4Description: https://datasheet.ciiva.com/15184/getdatasheetpartid-141001-15184860.pdf?src-supplier=Verical; Supplier Part Number 1: CT3110CT-ND
SW3 = SWITCH_DIP_2P_25mA_218-2LPSTR: Switch DIP ON OFF SPST 2 Recessed Slide 0.025A 24VDC Gull Wing 1000Cycles 1.27mm SMD T/R; Manufacturer: CTS; Voltage Rating (DC): 24V; Current Rating: 25mA; Number of Positions: 2; Actuator Type: Slide (Standard); Pitch: 0.05inch; Washable: Yes; Supplier 1: Digi-Key; Manufacturer Part Number: 218-2LPSTR; RoHS: Yes; Category: DIP Switches; Stock 1: 31125; Pricing 1: 1=0.97, 10=0.93, 25=0.8692, 100=0.7548, 250=0.6868, 500=0.6367, 1000=0.59021 (USD); Mount: Surface Mount; Contact Material: Copper; Contact Plating: Gold; Min Operating Temperature: -55°C; Max Operating Temperature: 85°C; Packaging: Tape and Reel; Throw Configuration: SPST; Termination: Gull Wing; Electrical Life: 1000Cycles; Series: 218; Package Quantity: 2000; Max Current Rating: 25mA; Orientation: Straight; Length: 0.146inch; Depth: 8.44mm; Radiation Hardening: No; Lead Free: Lead Free; RoHS Compliant: Yes; ComponentLink1URL: https://datasheet.ciiva.com/2865/218-2865152.pdf?src-supplier=Digi-Key; ComponentLink1Description: https://datasheet.ciiva.com/2865/218-2865152.pdf?src-supplier=Digi-Key; ComponentLink2URL: https://datasheet.ciiva.com/29890/218-29890939.pdf?src-supplier=Avnet; ComponentLink2Description: https://datasheet.ciiva.com/29890/218-29890939.pdf?src-supplier=Avnet; ComponentLink3URL: https://datasheet.ciiva.com/15184/getdatasheetpartid-224320-15184939.pdf?src-supplier=Verical; ComponentLink3Description: https://datasheet.ciiva.com/15184/getdatasheetpartid-224320-15184939.pdf?src-supplier=Verical; Supplier Part Number 1: CT3108CT-ND
U15 = IC_BUFFER_2CH_SN74LVC2G125DCUT: Buffer/Line Driver 2-CH Non-Inverting 3-ST CMOS 8-Pin VSSOP T/R; Manufacturer: Texas Instruments; Number of Elements: 2; Logic Function: Buffer,Inverting; Max Supply Voltage: 5.5V; Min Supply Voltage: 1.65V; Propagation Delay: 3.7ns; Number of Bits per Element: 1; High Level Output Current: -32mA; Low Level Output Current: 32mA; Turn-On Delay Time: 11.6ns; Quiescent Current: 10uA; Output Type: 3-STATE; Supplier 1: Digi-Key; Manufacturer Part Number: SN74LVC2G125DCUT; RoHS: Yes; Category: Buffers, Drivers and Transceivers; Stock 1: 3865; Pricing 1: 1=1.26, 10=1.126, 25=1.0688, 100=0.8781 (USD); Mount: Surface Mount; Case/Package: VSSOP; Number of Pins: 8; Min Operating Temperature: -40°C; Max Operating Temperature: 125°C; Packaging: Tape and Reel; Package Quantity: 250; Number of Channels: 2; Number of Inputs: 2; Number of Outputs: 2; Number of Input Lines: 2; Number of Output Lines: 2; Polarity: Non-Inverting; Termination: SMD/SMT; Number of Gates: 2; Number of Bits: 2; Series: 74LVC; Technology: CMOS; Radiation Hardening: No; Reach SVHC Compliant: No; Lead Free: Lead Free; RoHS Compliant: Yes; ComponentLink1URL: https://datasheet.ciiva.com/4788/sn74lvc2g125-50903-4788801.pdf?src-supplier=Mouser; ComponentLink1Description: https://datasheet.ciiva.com/4788/sn74lvc2g125-50903-4788801.pdf?src-supplier=Mouser; ComponentLink2URL: https://datasheet.ciiva.com/23785/1633705-23785564.pdf?src-supplier=Newark; ComponentLink2Description: https://datasheet.ciiva.com/23785/1633705-23785564.pdf?src-supplier=Newark; ComponentLink3URL: https://datasheet.ciiva.com/15094/getdatasheetpartid-40911-15094151.pdf?src-supplier=Verical; ComponentLink3Description: https://datasheet.ciiva.com/15094/getdatasheetpartid-40911-15094151.pdf?src-supplier=Verical; ComponentLink4URL: https://datasheet.ciiva.com/41455/001017176-da-01-en-ic-bus-buf-sn74lvc2g125dcut-vssop-8-tid-41455955.pdf?src-supplier=Conrad; ComponentLink4Description: https://datasheet.ciiva.com/41455/001017176-da-01-en-ic-bus-buf-sn74lvc2g125dcut-vssop-8-tid-41455955.pdf?src-supplier=Conrad; ComponentLink5URL: https://datasheet.ciiva.com/7744/1781747-7744025.pdf?src-supplier=Element14; ComponentLink5Description: https://datasheet.ciiva.com/7744/1781747-7744025.pdf?src-supplier=Element14; ComponentLink6URL: https://datasheet.ciiva.com/1841/sn74lvc2g125-1841967.pdf?src-supplier=Digi-Key; ComponentLink6Description: https://datasheet.ciiva.com/1841/sn74lvc2g125-1841967.pdf?src-supplier=Digi-Key; ComponentLink7URL: https://datasheet.ciiva.com/1841/sn74lvc2g125-1841966.pdf?src-supplier=Digi-Key; ComponentLink7Description: https://datasheet.ciiva.com/1841/sn74lvc2g125-1841966.pdf?src-supplier=Digi-Key; ComponentLink8URL: https://datasheet.ciiva.com/1841/sn74lvc2g125-1841968.pdf?src-supplier=Digi-Key; ComponentLink8Description: https://datasheet.ciiva.com/1841/sn74lvc2g125-1841968.pdf?src-supplier=Digi-Key; Supplier Part Number 1: 296-26616-1-ND
U16 = IC_VOLTAGE_SUPERVISOR_UM803RS: 3-Pin Microprocessor Reset Circuits; Manufacturer: Union Semiconductor; Supplier 1: Arrow Electronics; Manufacturer Part Number: UM803RS; RoHS: No; Stock 1: 2840; Pricing 1: 1=0.1121 (USD); Supplier Part Number 1: UM803RS